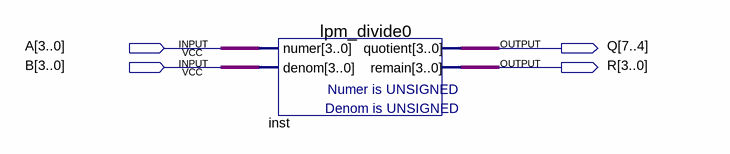
[diagram p0: schematic sheet]
// Quartus schematic lab_8_3.bdf as structural Verilog: 1 symbols, 4 pins
module lab_8_3 (
  input  [3:0] A,
  input  [3:0] B,
  output [7:4] Q,
  output [3:0] R
);

  lpm_divide0 inst (.numer(A), .denom(B), .quotient(Q), .remain(R));
endmodule
